# Altium project 175-00008 rev 2, M2 Focus Drive.PrjPCB
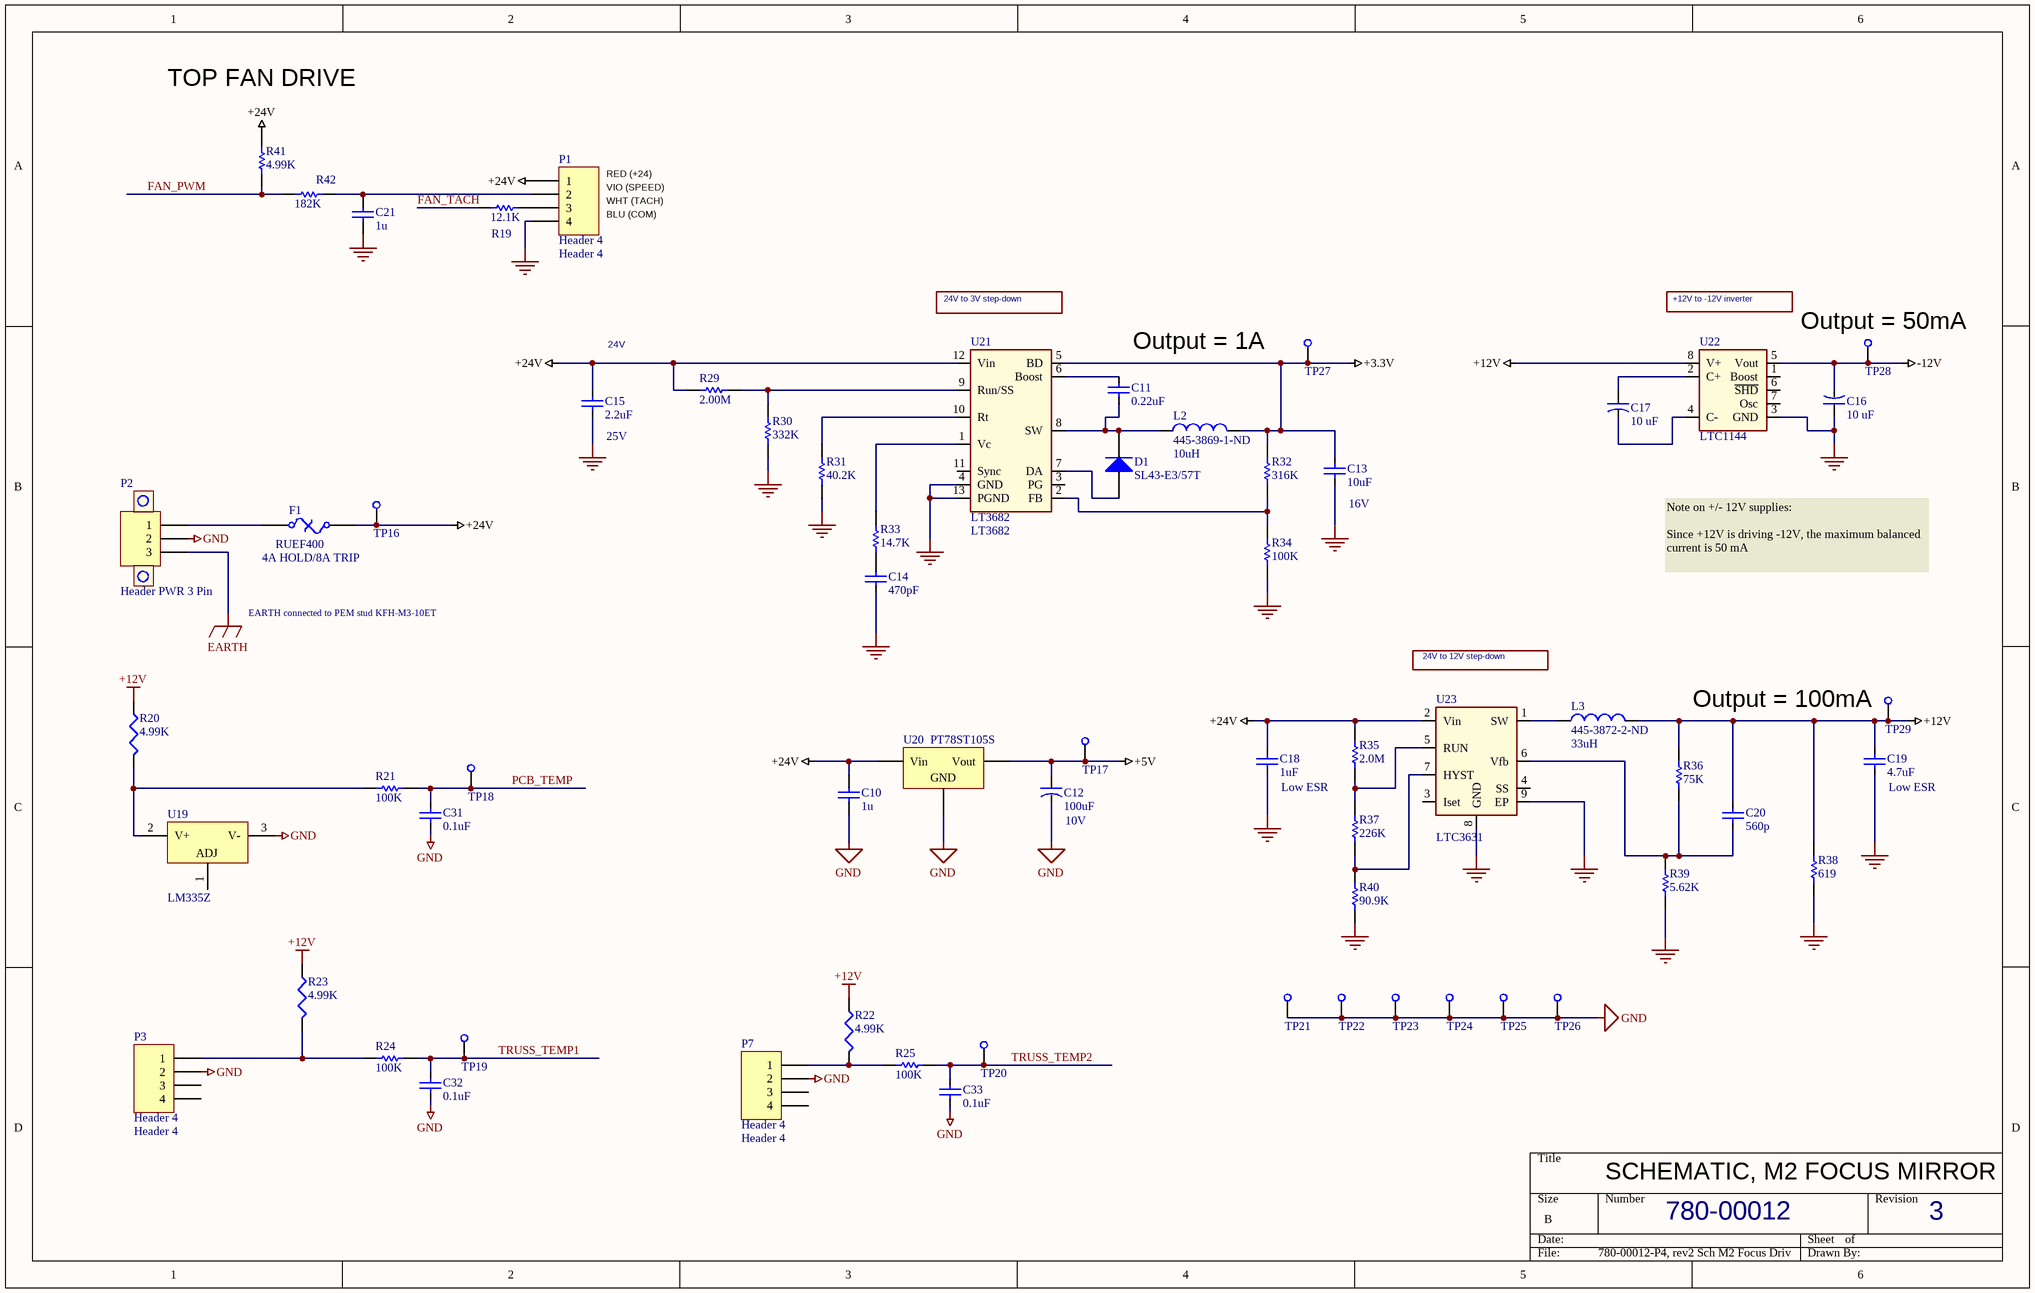
[diagram p0: 780-00012-P4, rev2 Sch M2 Focus Drive.SchDoc]
2 sheets, 111 parts. Net scope: global (net labels, ports and power ports of the same name join across sheets).
Board file: 175-00008 rev 2, PCB, M2 Focus Drive.PcbDoc
Sheets:
  780-00012-P4, rev2 Sch M2 Focus Drive.SchDoc
  780-00012-P2, rev2 Sch M2 Focus Drive.SchDoc

## Sheet 780-00012-P4, rev2 Sch M2 Focus Drive.SchDoc
size B; PageSetup: Record=PageOptions|CenterHorizontal=True|CenterVertical=True|PrintScale=1.09|XCorrection=1.00|YCorrection=1.00|PrintKind=0|BorderSize=5000000|LeftOffset=0|BottomOffset=0|Orientation=2|PaperLength=1000|PaperWidth=1000|Scale=100|PaperSource=7|PrintQuality=-4|MediaType=1|DitherType=10|PaperKind=Tabloid 11 x 17in|PrintScaleMode=1

### Parts
C10  1u  [2012[0805]]
C11  value 0.22uF  [SMD_0805]  (hidden comment: Cap SMD)
C12  10V  value 100uF  [SMD_CAP_7343]
C13  16V  value 10uF  [SMD_0805]
C14  value 470pF  [SMD_0805]  (hidden comment: Cap SMD)
C15  25V  value 2.2uF  [SMD_0805]
C16  value 10 uF  [SMD_CAP_3216]  (hidden comment: 16V)
C17  value 10 uF  [SMD_CAP_3216]  (hidden comment: 16V)
C18  Low ESR  value 1uF  [SMD_1206]
C19  Low ESR  value 4.7uF  [SMD_1206]
C20  value 560p  [SMD_0805]  (hidden comment: Cap SMD)
C21  1u  [2012[0805]]
C31  value 0.1uF  [SMD_0805]  (hidden comment: Cap SMD)
C32  value 0.1uF  [SMD_0805]  (hidden comment: Cap SMD)
C33  value 0.1uF  [SMD_0805]  (hidden comment: Cap SMD)
D1  SL43-E3/57T  [DO-214AB]
F1  RUEF400  value 4A HOLD/8A TRIP  [PolySwitch Radial 0.2]
L2  445-3869-1-ND  value 10uH  [Inductor TDC SLF]
L3  445-3872-2-ND  value 33uH  [Inductor TDC SLF]
P1  Header 4  [HDR1X4 for IDC]
P2  Header PWR 3 Pin  [HDR-3 pin w/screw]
P3  Header 4  [HDR1X4 for IDC]
P7  Header 4  [HDR1X4 for IDC]
R19  value 12.1K  [SMD_0805]  (hidden comment: Res 0805)
R20  value 4.99K  [smd_0805]  (hidden comment: Res3)
R21  value 100K  [SMD_0805]  (hidden comment: Res SMD)
R22  value 4.99K  [smd_0805]  (hidden comment: Res3)
R23  value 4.99K  [smd_0805]  (hidden comment: Res3)
R24  value 100K  [SMD_0805]  (hidden comment: Res SMD)
R25  value 100K  [SMD_0805]  (hidden comment: Res SMD)
R29  value 2.00M  [SMD_0805]  (hidden comment: Res 0805)
R30  value 332K  [SMD_0805]  (hidden comment: Res 0805)
R31  value 40.2K  [SMD_0805]  (hidden comment: Res 0805)
R32  value 316K  [SMD_0805]  (hidden comment: Res 0805)
R33  value 14.7K  [SMD_0805]  (hidden comment: Res 0805)
R34  value 100K  [SMD_0805]  (hidden comment: Res 0805)
R35  value 2.0M  [SMD_0805]  (hidden comment: Res 0805)
R36  value 75K  [SMD_0805]  (hidden comment: Res 0805)
R37  value 226K  [SMD_0805]  (hidden comment: Res 0805)
R38  value 619  [SMD_0805]  (hidden comment: Res 0805)
R39  value 5.62K  [SMD_0805]  (hidden comment: Res 0805)
R40  value 90.9K  [SMD_0805]  (hidden comment: Res 0805)
R41  value 4.99K  [SMD_0805]  (hidden comment: Res 0805)
R42  value 182K  [SMD_0805]  (hidden comment: Res 0805)
TP16  Test Point SMD  [SMD_TEST POINT]  (value not drawn)
TP17  Test Point SMD  [SMD_TEST POINT]  (value not drawn)
TP18  Test Point SMD  [SMD_TEST POINT]  (value not drawn)
TP19  Test Point SMD  [SMD_TEST POINT]  (value not drawn)
TP20  Test Point SMD  [SMD_TEST POINT]  (value not drawn)
TP21  Test Point SMD  [SMD_TEST POINT]  (value not drawn)
TP22  Test Point SMD  [SMD_TEST POINT]  (value not drawn)
TP23  Test Point SMD  [SMD_TEST POINT]  (value not drawn)
TP24  Test Point SMD  [SMD_TEST POINT]  (value not drawn)
TP25  Test Point SMD  [SMD_TEST POINT]  (value not drawn)
TP26  Test Point SMD  [SMD_TEST POINT]  (value not drawn)
TP27  Test Point SMD  [SMD_TEST POINT]  (value not drawn)
TP28  Test Point SMD  [SMD_TEST POINT]  (value not drawn)
TP29  Test Point SMD  [SMD_TEST POINT]  (value not drawn)
U19  LM335Z  [Z03A]
U20  PT78ST105S  [PSIP_3_SMD]
U21  LT3682  [DD12/DFN12]
U22  LTC1144  [S8_M]
U23  LTC3631  [DD8/DFN8]

### Nets
+3.3V: C13.2 L2.2 R32.2 TP27.1(TP) U21.5(BD)
+5V: C12.pos TP17.1(TP) U20.3(Vout)
+12V: C19.2 C20.2 L3.2 R20.1 R22.1 R23.1 R36.2 R38.2 TP29.1(TP) U22.8(V+)
+24V: C10.1 C15.2 C18.2 F1.2 P1.1 R29.1 R35.2 R41.2 TP16.1(TP) U20.1(Vin) U21.12(Vin) U23.2(Vin)
-12V: C16.2 TP28.1(TP) U22.5(Vout)
EARTH: P2.3
GND: C10.2 C12.neg C13.1 C14.1 C15.1 C16.1 C18.1 C19.1 C21.2 C31.1 C32.1 C33.1 P1.4 P2.2 P3.2 P7.2 R30.1 R31.1 R34.1 R38.1 R39.1 R40.1 TP21.1(TP) TP22.1(TP) TP23.1(TP) TP24.1(TP) TP25.1(TP) TP26.1(TP) U19.3(V-) U20.2(GND) U21.4(GND) U21.13(PGND) U22.3(GND) U23.8(GND) U23.9(EP)
SUPPORT: U20.0(SUPPORT)
FAN_PWM: R41.1 R42.1
FAN_TACH: R19.1
PCB_TEMP: C31.2 R21.1 TP18.1(TP)
TRUSS_TEMP1: C32.2 R24.1 TP19.1(TP)
TRUSS_TEMP2: C33.2 R25.1 TP20.1(TP)
NetC11_1: C11.1 D1.2(K) L2.1 U21.8(SW)
NetC11_2: C11.2 U21.6(Boost)
NetC14_2: C14.2 R33.1
NetC17_1: C17.1 U22.2(C+)
NetC17_2: C17.2 U22.4(C-)
NetC20_1: C20.1 R36.1 R39.2 U23.6(Vfb)
NetC21_1: C21.1 P1.2 R42.2
NetD1_1: D1.1(A) U21.7(DA)
NetF1_1: F1.1 P2.1
NetL3_1: L3.1 U23.1(SW)
NetP1_3: P1.3 R19.2
NetP3_1: P3.1 R23.2 R24.2
NetP7_1: P7.1 R22.2 R25.2
NetR20_2: R20.2 R21.2 U19.2(V+)
NetR29_2: R29.2 R30.2 U21.9(Run/SS)
NetR31_2: R31.2 U21.10(Rt)
NetR32_1: R32.1 R34.2 U21.2(FB)
NetR33_2: R33.2 U21.1(Vc)
NetR35_1: R35.1 R37.2 U23.5(RUN)
NetR37_1: R37.1 R40.2 U23.7(HYST)

Not connected (* = marked no-connect by the designer): P3 3 4; P7 3 4; U19 1(ADJ); U21 3(PG) 11(Sync); U22 1(Boost) 6(~{SHD}) 7(Osc); U23 3(Iset) 4(SS)

### Notes on the sheet
- TOP FAN DRIVE
- (near P1) RED (+24)
- (near P1) BLU (COM)
- (near P1) WHT (TACH)
- (near P1) VIO (SPEED)
- 24V to 3V step-down
- +12V to -12V inverter
- (near C15) 24V
- Output = 1A
- (near TP28) Output = 50mA
- Note on +/- 12V supplies:
  Since +12V is driving -12V, the maximum balanced current is 50 mA
- EARTH connected to PEM stud KFH-M3-10ET
- 24V to 12V step-down
- Output = 100mA
- SCHEMATIC, M2 FOCUS MIRROR
- 780-00012
- 3

### Library data of the parts
C10 C21 = Cap: Capacitor; Manufacturer: Taiyo Yuden; Manuf p/n: UMK212F105ZG-T; Vendor: DIGIKEY; Vendor Mult.: 10; Vendor p/n: 587-1308-1-ND; LCO p/n: 120-00027; Value: 1u; COST: 0.088
C11 = Cap SMD: Capacitor; LCO p/n: 120-00042
C12 = Cap Tant 35V: outline 6.0mm x 3.2mm; Manufacturer: kEMET; Manuf p/n: T520V107M010ATE045; Vendor: DigiKey; Vendor p/n: 399-4070-1-ND; Vendor Mult.: 1; LCO p/n: 120-00025; COST: 3.49
C13 = Cap SMD: Capacitor; LCO p/n: 120-00007
C14 = Cap SMD: Capacitor; LCO p/n: 120-00037
C15 = Cap SMD: Capacitor; Manufacturer: Taiyo Yuden; Manuf p/n: TMK212BJ225KG-T; Vendor: Digi-Key; Vendor p/n: 587-1292-1-ND; Vendor Mult.: 10; LCO p/n: 120-00038; COST: 0.275
C16 C17 = Cap Tant 16V: outline 3.2mm x 1.6mm; Manufacturer: KEMET; Manuf p/n: T494A106M016AT; Vendor: DIGIKEY; Vendor p/n: 399-3824-1-ND; Vendor Mult.: 1; LCO p/n: 120-00001; COST: 0.78
C18 = Cap SMD: Capacitor; Manufacturer: TDK; Manuf p/n: C3225X7R1H105K/1.6; Vendor: Digi-Key; Vendor p/n: 445-3931-1-ND; Vendor Mult.: 10; LCO p/n: 120-00039
C19 = Cap SMD: Capacitor; Manufacturer: TDK; Manuf p/n: C3216X7R1E475K; Vendor: Digi-Key; Vendor p/n: 445-1606-1-ND; Vendor Mult.: 10; LCO p/n: 120-00040
C20 = Cap SMD: Capacitor; LCO p/n: 120-00036
C31-C33 = Cap SMD: Capacitor; Manufacturer: AVX; Manuf p/n: 08055C104KAT2A; Vendor: DigiKey; Vendor p/n: 478-1395-1-ND; Vendor Mult.: 10; LCO p/n: 120-00002; COST: 0.09; Arena Type: Capacitor
D1 = Diode: Default Diode; Manufacturer: Vishay/Dale; Value: 4A 30V; Vendor: DigiKey; Vendor Mult.: 1; Vendor p/n: SL43-E3/57TGICT-ND; LCO p/n: 140-00002; COST: 0.98; Manuf p/n: SL43-E3/57T; Arena Type: Diode
F1 = Fuse Thermal: PolySwitch RUE Series; Manufacturer: Tyco Electronics; Vendor: DIGIKEY; Vendor Mult.: 1; Vendor p/n: RUEF400-ND; LCO p/n: 145-00003; COST: 0.50; Manuf p/n: RUEF400
L2 = Inductor SMD 10uH 1.8A: Inductor; Manufacturer: TDK; Manuf p/n: SLF7045T-100M1R8-H; Vendor: Digi-Key; Vendor Mult.: 1; LCO p/n: 155-00015; Vendor p/n: 445-3869-1-ND
L3 = Inductor SMD 10uH 1.8A: Inductor; Manufacturer: TDK; Manuf p/n: SLF7045T-330M1R1-H; Vendor: Digi-Key; Vendor Mult.: 1; LCO p/n: 155-00016; Vendor p/n: 445-3872-2-ND
P1 P3 P7 = Header 4: Header, 4-Pin; LCO p/n: 125-00037; VALUE: Header 4
P2 = Header 3 PWR: Header, 3-Pin; Manufacturer: Tyco; Manuf p/n: 796867-3; Vendor: DigiKey; Vendor p/n: A98308-ND; LCO p/n: 125-00095
R19 = Res SMD: Resistor 0805; Manufacturer: Vishay/Dale; Manuf p/n: CRCW080512.1KFKEA; Vendor: DIGIKEY; Vendor p/n: 541-12.1KCCT-ND; Vendor Mult.: 10; LCO p/n: 181-01211; COST: 0.09
R20 R22 R23 = Res3: Resistor; Manufacturer: DALE; Manuf p/n: CRCW08054.99KFKEA; Vendor: DigiKey; Vendor Mult.: 10; Vendor p/n: 541-4.99KCCT-ND; LCO p/n: 181-04991; COST: 0.09; Arena Type: Resistor
R21 R24 R25 = Res SMD: Resistor; Manufacturer: Vishay/Dale; Manuf p/n: CRCW0805100KFKEA; Vendor: DigiKey; Vendor p/n: 541-100KCCT-ND; Vendor Mult.: 10; LCO p/n: 181-01003; COST: 0.09; Arena Type: Resistor
R29 = Res SMD: Resistor 0805; Manufacturer: Vishay/Dale; Manuf p/n: CRCW08052.00MFKEA; Vendor: DIGIKEY; Vendor p/n: 541-2.00MCCT-ND; Vendor Mult.: 10; LCO p/n: 181-02004; COST: 0.09
R30 = Res SMD: Resistor 0805; Manufacturer: Vishay/Dale; Manuf p/n: CRCW0805332KFKEA; Vendor: DIGIKEY; Vendor p/n: 541-332KCCT-ND; Vendor Mult.: 10; LCO p/n: 181-03323; COST: 0.09
R31 = Res SMD: Resistor 0805; Manufacturer: Vishay/Dale; Manuf p/n: CRCW080540.2KFKEA; Vendor: DIGIKEY; Vendor p/n: 541-40.2KCCT-ND; Vendor Mult.: 10; LCO p/n: 181-04021; COST: 0.09
R32 = Res SMD: Resistor 0805; Manufacturer: Vishay/Dale; Manuf p/n: CRCW0805316KFKEA; Vendor: DIGIKEY; Vendor p/n: 541-316KCCT-ND; Vendor Mult.: 10; LCO p/n: 181-03163; COST: 0.09
R33 = Res SMD: Resistor 0805; Manufacturer: Vishay/Dale; Manuf p/n: CRCW080514.7KFKEA; Vendor: DIGIKEY; Vendor p/n: 541-14.7KCCT-ND; Vendor Mult.: 10; LCO p/n: 181-01472; COST: 0.09
R34 = Res SMD: Resistor 0805; Manufacturer: Vishay/Dale; Manuf p/n: CRCW0805100KFKEA; Vendor: DIGIKEY; Vendor p/n: 541-100KCCT-ND; Vendor Mult.: 10; LCO p/n: 181-01003; COST: 0.09
R35 = Res SMD: Resistor 0805; Manufacturer: Vishay/Dale; Manuf p/n: CRCW08052.0MFKEA; Vendor: DIGIKEY; Vendor p/n: 541-2.0MCCT-ND; Vendor Mult.: 10; LCO p/n: 181-02004; COST: 0.09
R36 = Res SMD: Resistor 0805; Manufacturer: Vishay/Dale; Manuf p/n: CRCW080575KFKEA; Vendor: DIGIKEY; Vendor p/n: 541-75KCCT-ND; Vendor Mult.: 10; LCO p/n: 181-07502; COST: 0.09
R37 = Res SMD: Resistor 0805; Manufacturer: Vishay/Dale; Manuf p/n: CRCW0805226KFKEA; Vendor: DIGIKEY; Vendor p/n: 541-226KCCT-ND; Vendor Mult.: 10; LCO p/n: 181-02263; COST: 0.09
R38 = Res SMD: Resistor 0805; Manufacturer: Vishay/Dale; Manuf p/n: CRCW0805619FKEA; Vendor: DIGIKEY; Vendor p/n: 541-619CCT-ND; Vendor Mult.: 10; LCO p/n: 181-06190; COST: 0.09
R39 = Res SMD: Resistor 0805; Manufacturer: Vishay/Dale; Manuf p/n: CRCW08055.62KFKEA; Vendor: DIGIKEY; Vendor p/n: 541-5.62KCCT-ND; Vendor Mult.: 10; LCO p/n: 181-05621; COST: 0.09
R40 = Res SMD: Resistor 0805; Manufacturer: Vishay/Dale; Manuf p/n: CRCW080590.9KFKEA; Vendor: DIGIKEY; Vendor p/n: 541-90.9KCCT-ND; Vendor Mult.: 10; LCO p/n: 181-09092; COST: 0.09
R41 = Res SMD: Resistor 0805; Manufacturer: Vishay/Dale; Manuf p/n: CRCW08054.99KFKEA; Vendor: DIGIKEY; Vendor p/n: 541-4.99KCCT-ND; Vendor Mult.: 10; LCO p/n: 181-04991; COST: 0.09
R42 = Res SMD: Resistor 0805; Manufacturer: Vishay/Dale; Manuf p/n: CRCW0805182KFKEA; Vendor: DIGIKEY; Vendor p/n: 541-182KCCT-ND; Vendor Mult.: 10; LCO p/n: 181-01823; COST: 0.09
TP16-TP29 = Test Point SMD: SMD loop test point; LCO p/n: 160-00001; VALUE: Test Point SMD
U19 = LM335Z: Precision Temperature Sensor; Manufacturer: National Semiconductor; LCO p/n: 150-00068
U20 = Volt Reg: Voltage Regulator; Manufacturer: Texas Instruments; Vendor: DIGIKEY; Vendor Mult.: 1; Vendor p/n: PT78ST105S-ND; LCO p/n: 150-00013; COST: 14.41; Manuf p/n: PT78ST105S; Value: PT78ST105S
U21 = LT3682: 1A uPwr Step-Down switching regulator; Manufacturer: Linear; Manuf p/n: LT3682EDD#PBF; LCO p/n: 150-00069; Vendor: Digi-Key; Vendor Mult.: 1; Vendor p/n: LT3682EDD#PBF-ND; COST: 6.28; VALUE: LT3682
U22 = LTC1144: IC VOLT CONV SW-CAP W/SHTDN8SOIC; Manufacturer: Linear; Manuf p/n: LTC1144CS8#PBF; LCO p/n: 150-00070; Vendor: Digi_Key; Vendor Mult.: 1; Vendor p/n: LTC1144CS8#PBF-ND; COST: 4.90; VALUE: LTC1144
U23 = LTC3631: IC CONV STP-DWN ADJ 8-DFN; Manufacturer: Linear; Manuf p/n: LTC3631EDD#PBF; LCO p/n: 150-00071; Vendor: Digi-Key; Vendor Mult.: 1; Vendor p/n: LTC3631EDD#PBF-ND; COST: 6.28; VALUE: LTC3631

## Sheet 780-00012-P2, rev2 Sch M2 Focus Drive.SchDoc
size B; PageSetup: Record=PageOptions|CenterHorizontal=True|CenterVertical=True|PrintScale=1.09|XCorrection=1.00|YCorrection=1.00|PrintKind=0|BorderSize=5000000|LeftOffset=0|BottomOffset=0|Orientation=2|PaperLength=1000|PaperWidth=1000|Scale=100|PaperSource=7|PrintQuality=-4|MediaType=1|DitherType=10|PaperKind=Tabloid 11 x 17in|PrintScaleMode=1
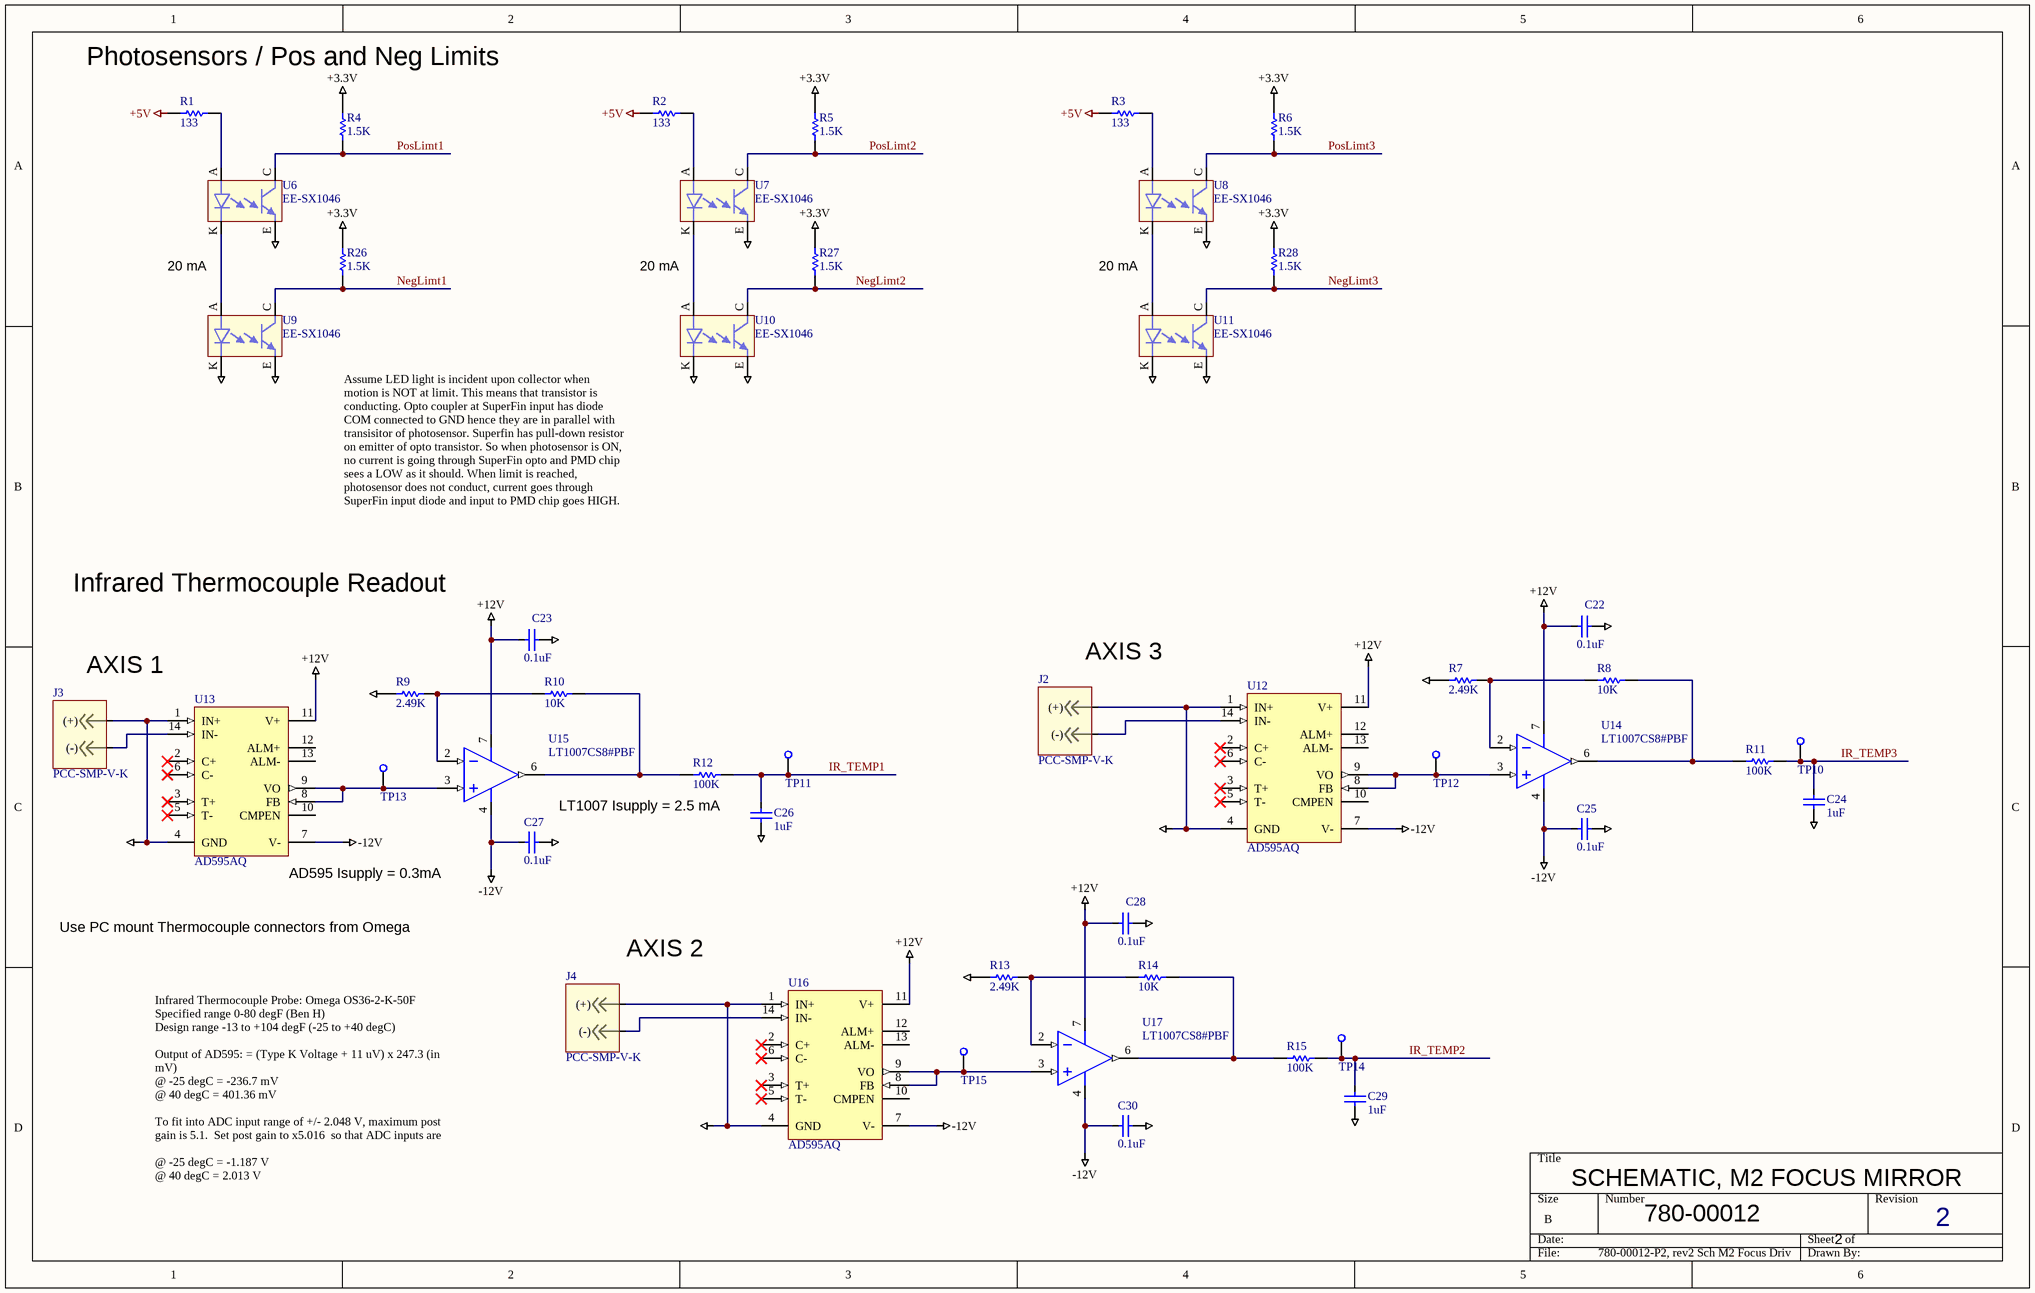
[diagram p1: 780-00012-P2, rev2 Sch M2 Focus Drive.SchDoc]

### Parts
C22  value 0.1uF  [SMD_0805]  (hidden comment: Cap SMD)
C23  value 0.1uF  [SMD_0805]  (hidden comment: Cap SMD)
C24  value 1uF  [SMD_0805]  (hidden comment: Cap SMD)
C25  value 0.1uF  [SMD_0805]  (hidden comment: Cap SMD)
C26  value 1uF  [SMD_0805]  (hidden comment: Cap SMD)
C27  value 0.1uF  [SMD_0805]  (hidden comment: Cap SMD)
C28  value 0.1uF  [SMD_0805]  (hidden comment: Cap SMD)
C29  value 1uF  [SMD_0805]  (hidden comment: Cap SMD)
C30  value 0.1uF  [SMD_0805]  (hidden comment: Cap SMD)
J2  PCC-SMP-V-K  [THERMOCOUPLE]
J3  PCC-SMP-V-K  [THERMOCOUPLE]
J4  PCC-SMP-V-K  [THERMOCOUPLE]
R1  value 133  [SMD_0805]  (hidden comment: Res 0805)
R2  value 133  [SMD_0805]  (hidden comment: Res 0805)
R3  value 133  [SMD_0805]  (hidden comment: Res 0805)
R4  value 1.5K  [SMD_0805]  (hidden comment: Res 0805)
R5  value 1.5K  [SMD_0805]  (hidden comment: Res 0805)
R6  value 1.5K  [SMD_0805]  (hidden comment: Res 0805)
R7  value 2.49K  [SMD_0805]  (hidden comment: Res 0805)
R8  value 10K  [SMD_0805]  (hidden comment: Res 0805)
R9  value 2.49K  [SMD_0805]  (hidden comment: Res 0805)
R10  value 10K  [SMD_0805]  (hidden comment: Res 0805)
R11  value 100K  [SMD_0805]  (hidden comment: Res 0805)
R12  value 100K  [SMD_0805]  (hidden comment: Res 0805)
R13  value 2.49K  [SMD_0805]  (hidden comment: Res 0805)
R14  value 10K  [SMD_0805]  (hidden comment: Res 0805)
R15  value 100K  [SMD_0805]  (hidden comment: Res 0805)
R26  value 1.5K  [SMD_0805]  (hidden comment: Res 0805)
R27  value 1.5K  [SMD_0805]  (hidden comment: Res 0805)
R28  value 1.5K  [SMD_0805]  (hidden comment: Res 0805)
TP10  Test Point SMD  [SMD_TEST POINT]  (value not drawn)
TP11  Test Point SMD  [SMD_TEST POINT]  (value not drawn)
TP12  Test Point SMD  [SMD_TEST POINT]  (value not drawn)
TP13  Test Point SMD  [SMD_TEST POINT]  (value not drawn)
TP14  Test Point SMD  [SMD_TEST POINT]  (value not drawn)
TP15  Test Point SMD  [SMD_TEST POINT]  (value not drawn)
U6  EE-SX1046  [Photo-sensor]
U7  EE-SX1046  [Photo-sensor]
U8  EE-SX1046  [Photo-sensor]
U9  EE-SX1046  [Photo-sensor]
U10  EE-SX1046  [Photo-sensor]
U11  EE-SX1046  [Photo-sensor]
U12  AD595AQ  [Q-14_A]
U13  AD595AQ  [Q-14_A]
U14  LT1007CS8#PBF  [S8_M]
U15  LT1007CS8#PBF  [S8_M]
U16  AD595AQ  [Q-14_A]
U17  LT1007CS8#PBF  [S8_M]

### Nets
+3.3V: R4.2 R5.2 R6.2 R26.2 R27.2 R28.2
+5V: R1.2 R2.2 R3.2
+12V: C22.2 C23.2 C28.2 U12.11(V+) U13.11(V+) U14.7(V+) U15.7(V+) U16.11(V+) U17.7(V+)
-12V: C25.2 C27.2 C30.2 U12.7(V-) U13.7(V-) U14.4(V-) U15.4(V-) U16.7(V-) U17.4(V-)
GND: C22.1 C23.1 C24.1 C25.1 C26.1 C27.1 C28.1 C29.1 C30.1 J2.1((+)) J3.1((+)) J4.1((+)) R7.1 R9.1 R13.1 U6.E(emitter) U7.E(emitter) U8.E(emitter) U9.E(emitter) U9.K(cathode) U10.E(emitter) U10.K(cathode) U11.E(emitter) U11.K(cathode) U12.1(IN+) U12.4(GND) U13.1(IN+) U13.4(GND) U16.1(IN+) U16.4(GND)
IR_TEMP1: C26.2 R12.2 TP11.1(TP)
IR_TEMP2: C29.2 R15.2 TP14.1(TP)
IR_TEMP3: C24.2 R11.2 TP10.1(TP)
NegLimt1: R26.1 U9.C(collector)
NegLimt2: R27.1 U10.C(collector)
NegLimt3: R28.1 U11.C(collector)
PosLimt1: R4.1 U6.C(collector)
PosLimt2: R5.1 U7.C(collector)
PosLimt3: R6.1 U8.C(collector)
NetJ2_2: J2.2((-)) U12.14(IN-)
NetJ3_2: J3.2((-)) U13.14(IN-)
NetJ4_2: J4.2((-)) U16.14(IN-)
NetR1_1: R1.1 U6.A(anode)
NetR2_1: R2.1 U7.A(anode)
NetR3_1: R3.1 U8.A(anode)
NetR7_2: R7.2 R8.1 U14.2(IN-)
NetR8_2: R8.2 R11.1 U14.6(OUT)
NetR9_2: R9.2 R10.1 U15.2(IN-)
NetR10_2: R10.2 R12.1 U15.6(OUT)
NetR13_2: R13.2 R14.1 U17.2(IN-)
NetR14_2: R14.2 R15.1 U17.6(OUT)
NetTP12_1: TP12.1(TP) U12.8(FB) U12.9(VO) U14.3(IN+)
NetTP13_1: TP13.1(TP) U13.8(FB) U13.9(VO) U15.3(IN+)
NetTP15_1: TP15.1(TP) U16.8(FB) U16.9(VO) U17.3(IN+)
NetU6_K: U6.K(cathode) U9.A(anode)
NetU7_K: U7.K(cathode) U10.A(anode)
NetU8_K: U8.K(cathode) U11.A(anode)

Not connected (* = marked no-connect by the designer): U12 2(C+)* 3(T+)* 5(T-)* 6(C-)* 10(CMPEN) 12(ALM+) 13(ALM-); U13 2(C+)* 3(T+)* 5(T-)* 6(C-)* 10(CMPEN) 12(ALM+) 13(ALM-); U14 1(VOSTRIM) 5(NC) 8(VOSTRIM); U15 1(VOSTRIM) 5(NC) 8(VOSTRIM); U16 2(C+)* 3(T+)* 5(T-)* 6(C-)* 10(CMPEN) 12(ALM+) 13(ALM-); U17 1(VOSTRIM) 5(NC) 8(VOSTRIM)

### Notes on the sheet
- Photosensors / Pos and Neg Limits
- 20 mA
- Assume LED light is incident upon collector when motion is NOT at limit. This means that transistor is conducting. Opto coupler at SuperFin input has diode COM connected to GND hence they are in parallel with transisitor of photosensor. Superfin has pull-down resistor on emitter of opto transistor. So when photosensor is ON, no current is going through SuperFin opto and PMD chip sees a LOW as it should. When limit is reached, photosensor does not conduct, current goes through SuperFin input diode and input to PMD chip goes HIGH.
- Infrared Thermocouple Readout
- AXIS 1
- (near J2) AXIS 3
- LT1007 Isupply = 2.5 mA
- (near U13) AD595 Isupply = 0.3mA
- Use PC mount Thermocouple connectors from Omega
- (near J4) AXIS 2
- Infrared Thermocouple Probe: Omega OS36-2-K-50F
  Specified range 0-80 degF (Ben H)
  Design range -13 to +104 degF (-25 to +40 degC)
  Output of AD595: = (Type K Voltage + 11 uV) x 247.3 (in mV)
  @ -25 degC = -236.7 mV
  @ 40 degC = 401.36 mV
  To fit into ADC input range of +/- 2.048 V, maximum post gain is 5.1.  Set post gain to x5.016  so that ADC inputs are
  @ -25 degC = -1.187 V
  @ 40 degC = 2.013 V
- SCHEMATIC, M2 FOCUS MIRROR
- 780-00012
- 2

### Library data of the parts
C22 C23 C25 C27 C28 C30 = Cap SMD: Capacitor; LCO p/n: 120-00002
C24 C26 C29 = Cap SMD: Capacitor; LCO p/n: 120-00006
J2-J4 = Thermocouple Connector: T/C Conn PCB mount vertical; LCO p/n: 125-00042
R1-R3 = Res SMD: Resistor 0805; Manufacturer: Vishay/Dale; Manuf p/n: CRCW0805133FKEA; Vendor: DIGIKEY; Vendor p/n: 541-133CCT-ND; Vendor Mult.: 10; LCO p/n: 181-01330; COST: 0.09
R4-R6 R26-R28 = Res SMD: Resistor 0805; Manufacturer: Vishay/Dale; Manuf p/n: CRCW08051.5KFKEA; Vendor: DIGIKEY; Vendor p/n: 541-1.5KCCT-ND; Vendor Mult.: 10; LCO p/n: 181-01501; COST: 0.09
R7 R9 R13 = Res SMD: Resistor 0805; Manufacturer: Vishay/Dale; Manuf p/n: CRCW08052.49KFKEA; Vendor: DIGIKEY; Vendor p/n: 541-2.49KCCT-ND; Vendor Mult.: 10; LCO p/n: 181-02491; COST: 0.09
R8 R10 R14 = Res SMD: Resistor 0805; Manufacturer: Vishay/Dale; Manuf p/n: CRCW080510KFKEA; Vendor: DIGIKEY; Vendor p/n: 541-10KCCT-ND; Vendor Mult.: 10; LCO p/n: 181-01002; COST: 0.09
R11 R12 R15 = Res SMD: as R34 on sheet 780-00012-P4, rev2 Sch M2 Focus Drive; COST: 0.09
TP10-TP15 = Test Point SMD: SMD loop test point; LCO p/n: 160-00001; VALUE: Test Point SMD
U6-U11 = Photo-sensor: Omron EE-SX1046; LCO p/n: 135-00001
U12 U13 U16 = AD595AQ: Monolithic Thermocouple Amplifier with Cold Junction Compensation; Manufacturer: Analog Devices; LCO p/n: 150-00066; Vendor: Digi-Key; Vendor Mult.: 1; Vendor p/n: AD595AQ-ND; COST: 12.35; Manuf p/n: AD595AQ; VALUE: AD595AQ
U14 U15 U17 = LT1007CS8#PBF: Low Noise BJT input opamp; Manufacturer: Linear Tech; LCO p/n: 150-00067; VALUE: LT1007; Vendor: DigiKey; Vendor Mult.: 1; Vendor p/n: LT1007CS8#PBF-ND; COST: 4.13; Manuf p/n: LT1007CS8#PBF

## Nets that join several sheets
+3.3V: 780-00012-P4, rev2 Sch M2 Focus Drive (5 pins), 780-00012-P2, rev2 Sch M2 Focus Drive (6 pins)
+5V: 780-00012-P4, rev2 Sch M2 Focus Drive (C12.pos TP17.1 U20.3), 780-00012-P2, rev2 Sch M2 Focus Drive (R1.2 R2.2 R3.2)
+12V: 780-00012-P4, rev2 Sch M2 Focus Drive (10 pins), 780-00012-P2, rev2 Sch M2 Focus Drive (9 pins)
-12V: 780-00012-P4, rev2 Sch M2 Focus Drive (C16.2 TP28.1 U22.5), 780-00012-P2, rev2 Sch M2 Focus Drive (9 pins)
GND: 780-00012-P4, rev2 Sch M2 Focus Drive (35 pins), 780-00012-P2, rev2 Sch M2 Focus Drive (30 pins)